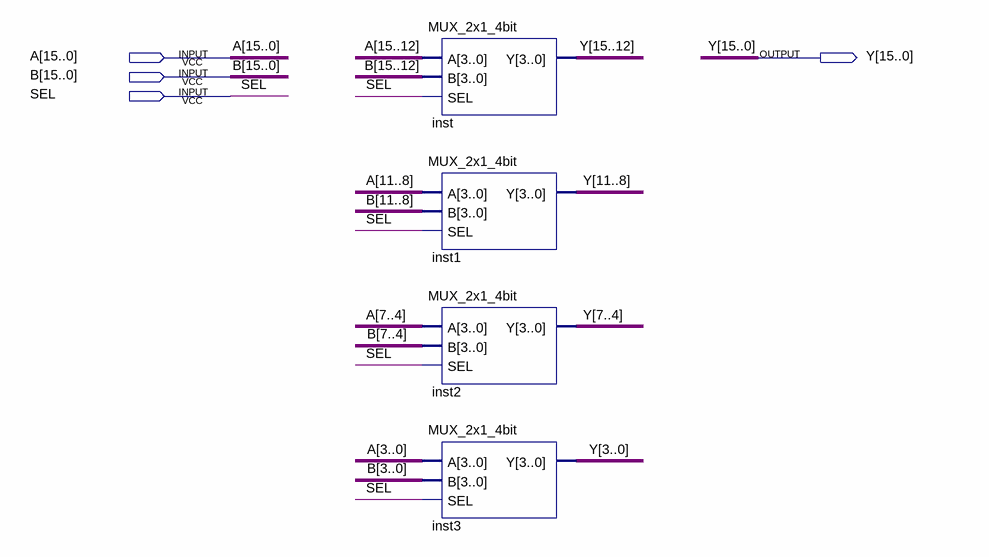
[diagram p0: schematic sheet]
// Quartus schematic MUX_2x1_16bit.bdf as structural Verilog: 4 symbols, 4 pins
module MUX_2x1_16bit (
  input  [15:0] A,
  input  [15:0] B,
  input  SEL,
  output [15:0] Y
);

  MUX_2x1_4bit inst (.A(A[15:12]), .B(B[15:12]), .SEL(SEL), .Y(Y[15:12]));
  MUX_2x1_4bit inst1 (.A(A[11:8]), .B(B[11:8]), .SEL(SEL), .Y(Y[11:8]));
  MUX_2x1_4bit inst2 (.A(A[7:4]), .B(B[7:4]), .SEL(SEL), .Y(Y[7:4]));
  MUX_2x1_4bit inst3 (.A(A[3:0]), .B(B[3:0]), .SEL(SEL), .Y(Y[3:0]));
endmodule
